# EAGLE design knife (EAGLE 7.2.0)
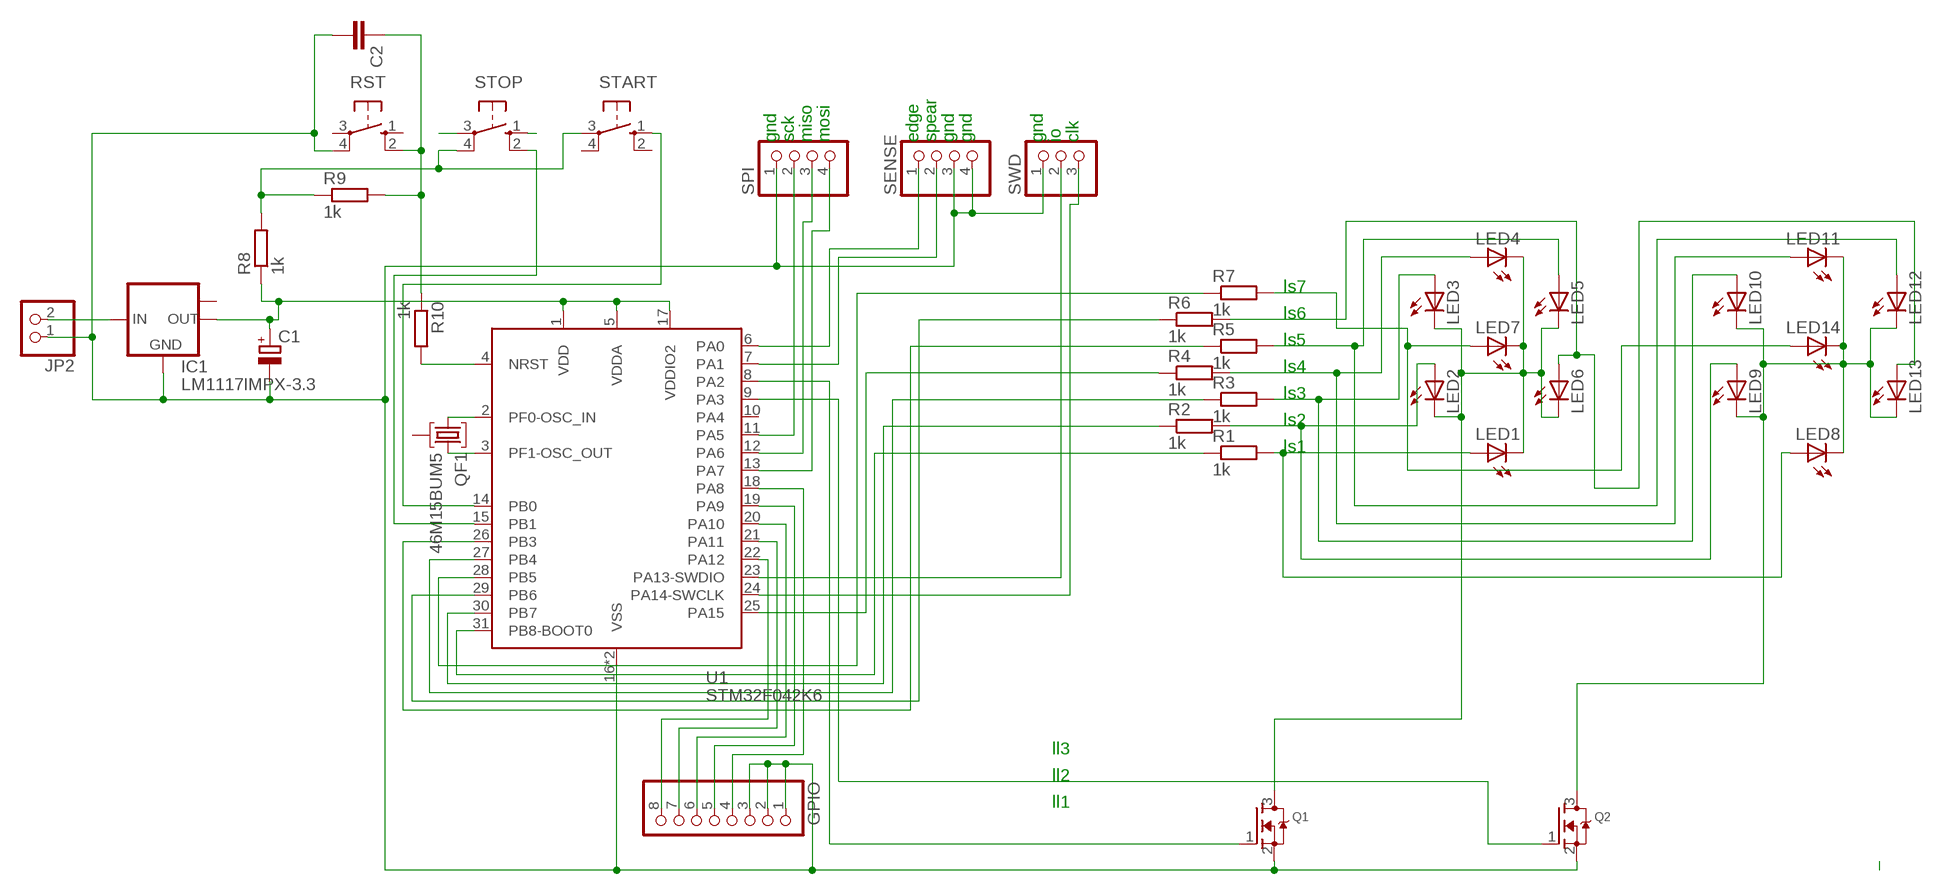
[diagram p0: schematic, sheet 1]

## Parts
C1  CPOL-EUSMCD  [SMC_D]
C2  C-EUC1206  [C1206]
GPIO  PINHD-1X8  [1X08]
IC1  LM1117IMPX-3.3  [SOT223]
JP2  PINHD-1X2  [1X02]
LED1  LEDSQR2X5  [LED2X5]
LED2  LEDSQR2X5  [LED2X5]
LED3  LEDSQR2X5  [LED2X5]
LED4  LEDSQR2X5  [LED2X5]
LED5  LEDSQR2X5  [LED2X5]
LED6  LEDSQR2X5  [LED2X5]
LED7  LEDSQR2X5  [LED2X5]
LED8  LEDSQR2X5  [LED2X5]
LED9  LEDSQR2X5  [LED2X5]
LED10  LEDSQR2X5  [LED2X5]
LED11  LEDSQR2X5  [LED2X5]
LED12  LEDSQR2X5  [LED2X5]
LED13  LEDSQR2X5  [LED2X5]
LED14  LEDSQR2X5  [LED2X5]
Q1  MOSFET-NREFLOW  [SOT23]
Q2  MOSFET-NREFLOW  [SOT23]
QF1  46M15BUM5  [UM5]
R1  1k  R-EU_R0805  [R0805]
R2  1k  R-EU_R0805  [R0805]
R3  1k  R-EU_R0805  [R0805]
R4  1k  R-EU_R0805  [R0805]
R5  1k  R-EU_R0805  [R0805]
R6  1k  R-EU_R0805  [R0805]
R7  1k  R-EU_R0805  [R0805]
R8  1k  R-EU_R1206  [R1206]
R9  1k  R-EU_R1206  [R1206]
R10  1k  R-EU_R1206  [R1206]
RST  10-XX  [B3F-10XX]
SENSE  PINHD-1X4  [1X04]
SPI  PINHD-1X4  [1X04]
START  10-XX  [B3F-10XX]
STOP  10-XX  [B3F-10XX]
SWD  PINHD-1X3  [1X03]
U1  STM32F042K6  [QFP32-7X7]

## Nets
N$1: LED1.K(C) LED2.K(C) LED3.K(C) LED4.K(C) LED5.K(C) LED6.K(C) LED7.K(C) Q1.3(D)
N$4: LED1.A LED8.A R1.2
N$5: LED2.A LED9.A R2.2
N$6: LED3.A LED10.A R3.2
N$7: R7.1 U1.28(PB5)
N$8: R6.1 U1.29(PB6)
N$9: LED4.A LED11.A R4.2
N$10: LED5.A LED12.A R5.2
N$11: R5.1 U1.26(PB3)
N$12: R4.1 U1.25(PA15)
N$13: LED6.A LED13.A R6.2
N$14: LED7.A LED14.A R7.2
N$15: R3.1 U1.27(PB4)
N$16: R2.1 U1.30(PB7)
N$18: LED8.K(C) LED9.K(C) LED10.K(C) LED11.K(C) LED12.K(C) LED13.K(C) LED14.K(C) Q2.3(D)
N$19: R1.1 U1.31(PB8-BOOT0)
N$22: Q2.1(G) U1.9(PA3)
N$23: Q1.1(G) U1.8(PA2)
N$24: C1.- C2.2 GPIO.1 GPIO.2 GPIO.3 IC1.1(GND) JP2.1 Q1.2(S) Q2.2(S) RST.4(P1) SENSE.3 SENSE.4 SPI.1 SWD.1 U1.16(VSS) U1.32(VSS)
N$25: SPI.2 U1.11(PA5)
N$26: SPI.3 U1.12(PA6)
N$27: SPI.4 U1.13(PA7)
N$28: C1.+ IC1.2(OUT) R8.1 U1.1(VDD) U1.5(VDDA) U1.17(VDDIO2)
N$29: QF1.1 U1.2(PF0-OSC_IN)
N$30: QF1.3 U1.3(PF1-OSC_OUT)
N$31: IC1.3(IN) JP2.2
N$32: R8.2 R9.1 START.3(P) STOP.4(P1)
N$33: START.1(S) U1.14(PB0)
N$34: STOP.2(S1) U1.15(PB1)
N$35: C2.1 R9.2 R10.1 RST.2(S1)
N$36: SENSE.1 U1.6(PA0)
N$37: SENSE.2 U1.7(PA1)
N$38: SWD.2 U1.23(PA13-SWDIO)
N$39: SWD.3 U1.24(PA14-SWCLK)
N$40: R10.2 U1.4(NRST)
N$41: GPIO.8 U1.22(PA12)
N$42: GPIO.7 U1.21(PA11)
N$43: GPIO.6 U1.20(PA10)
N$44: GPIO.5 U1.19(PA9)
N$45: GPIO.4 U1.18(PA8)
N$46: STOP.3(P)
N$47: STOP.1(S)
Unconnected: IC1.TAB(OUT1) QF1.2 RST.1(S) RST.3(P) START.2(S1) START.4(P1) U1.10(PA4)

## Notes on the sheet
- gnd | sck | miso | mosi | edge | spear | gnd | gnd | gnd | io | clk
- ls7
- ls6
- ls5
- ls4
- ls3
- ls2
- ls1
- ll3
- ll2
- ll1

## Library data of the parts
C1 = resistor:CPOL-EU: POLARIZED CAPACITOR, European symbol
C2 = resistor:C-EU: CAPACITOR, European symbol
GPIO = pinhead:PINHD-1X8: PIN HEADER
IC1 = lm1117:LM1117IMPX-*
JP2 = pinhead:PINHD-1X2: PIN HEADER
LED1-LED14 = led:LED: LED OSRAM: - CHIPLED LG R971, LG N971, LY N971, LG Q971, LY Q971, LO R971, LY R971 LH N974, LH R974 LS Q976, LO Q976, LY Q976 LO Q996 - Hyper CHIPLED LW Q18S LB Q993, LB Q99A, LB R99A - SideLED LS A670, LO A670, LY A670, LG A670, LP A670 LB A673, LV A673, LT A673, LW A673 LH A674 LY A675 LS A676, LA A676, LO A676, LY A676, LW A676 LS A679, LY A679, LG A679 - Hyper Micro SIDELED® LS Y876, LA Y876, LO Y876, LY Y876 LT Y87S - SmartLED LW L88C, LW L88S LB L89C, LB L89S, LG L890 LS L89K, LO L89K, LY L89K LS L896, LA L896, LO L896, LY L896 - TOPLED LS T670, LO T670, LY T670, LG T670, LP T670 LSG T670, LSP T670, LSY T670, LOP T670, LYG T670 LG T671, LOG T671, LSG T671 LB T673, LV T673, LT T673, LW T673 LH T674 LS T676, LA T676, LO T676, LY T676, LB T676, LH T676, LSB T676, LW T676 LB T67C, LV T67C, LT T67C, LS T67K, LO T67K, LY T67K, LW E67C LS E67B, LA E67B, LO E67B, LY E67B, LB E67C, LV E67C, LT E67C LW T67C LS T679, LY T679, LG T679 LS T770, LO T770, LY T770, LG T770, LP T770 LB T773, LV T773, LT T773, LW T773 LH T774 LS E675, LA E675, LY E675, LS T675 LS T776, LA T776, LO T776, LY T776, LB T776 LHGB T686 LT T68C, LB T68C - Hyper Mini TOPLED® LB M676 - Mini TOPLED Santana® LG M470 LS M47K, LO M47K, LY M47K Source: http://www.osram.convergy.de LUXEON: - LUMILED® LXK2-PW12-R00, LXK2-PW12-S00, LXK2-PW14-U00, LXK2-PW14-V00 LXK2-PM12-R00, LXK2-PM12-S00, LXK2-PM14-U00 LXK2-PE12-Q00, LXK2-PE12-R00, LXK2-PE12-S00, LXK2-PE14-T00, LXK2-PE14-U00 LXK2-PB12-K00, LXK2-PB12-L00, LXK2-PB12-M00, LXK2-PB14-N00, LXK2-PB14-P00, LXK2-PB14-Q00 LXK2-PR12-L00, LXK2-PR12-M00, LXK2-PR14-Q00, LXK2-PR14-R00 LXK2-PD12-Q00, LXK2-PD12-R00, LXK2-PD12-S00 LXK2-PH12-R00, LXK2-PH12-S00 LXK2-PL12-P00, LXK2-PL12-Q00, LXK2-PL12-R00 Source: www.luxeon.com KINGBRIGHT: KA-3528ASYC Source: www.kingbright.com
Q1 Q2 = adafruit:MOSFET-N: N-Channel Mosfet 2N7002E - 60V 260mA SOT23 [Digikey: 2N7002ET1GOSTR-ND] - REEL BSH103 - 30V 850mA SOT23 [Digikey: 568-5013-1-ND]
QF1 = crystal:46M15BUM5: Monolithic Crystal Filters Source: www.vanlong.com; OC_FARNELL: unknown; OC_NEWARK: unknown
R1-R7 = resistor:R-EU_: RESISTOR, European symbol
R8-R10 = rcl:R-EU_: RESISTOR, European symbol
RST START STOP = switch-omron:10-XX: OMRON SWITCH; MPN: B3F-1000; OC_FARNELL: 176432; OC_NEWARK: 36M3542
SENSE SPI = pinhead:PINHD-1X4: PIN HEADER
SWD = pinhead:PINHD-1X3: PIN HEADER
U1 = STM32F042K:STM32F042K6

## Board
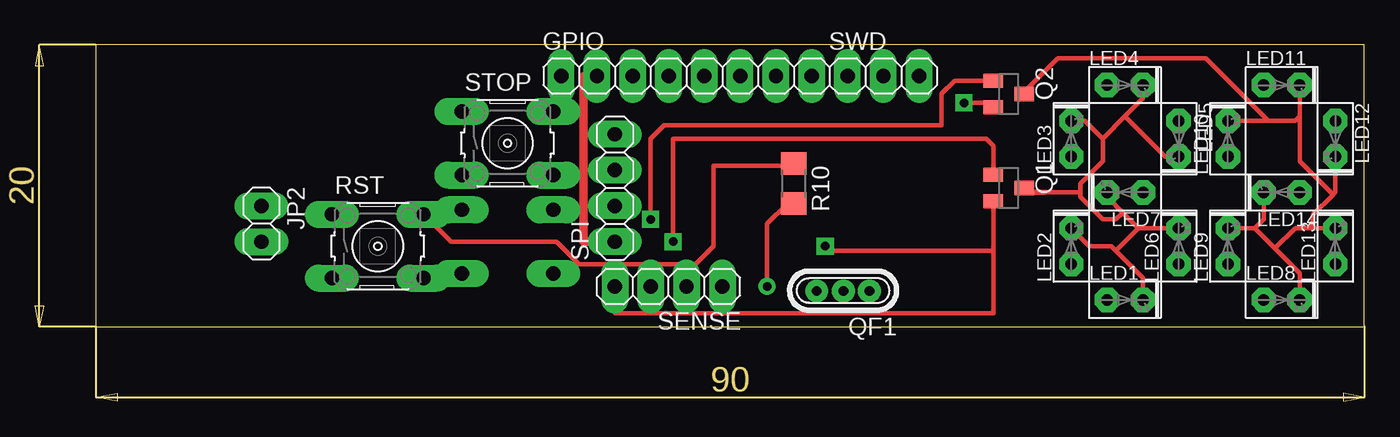
[diagram p1: board, top side]
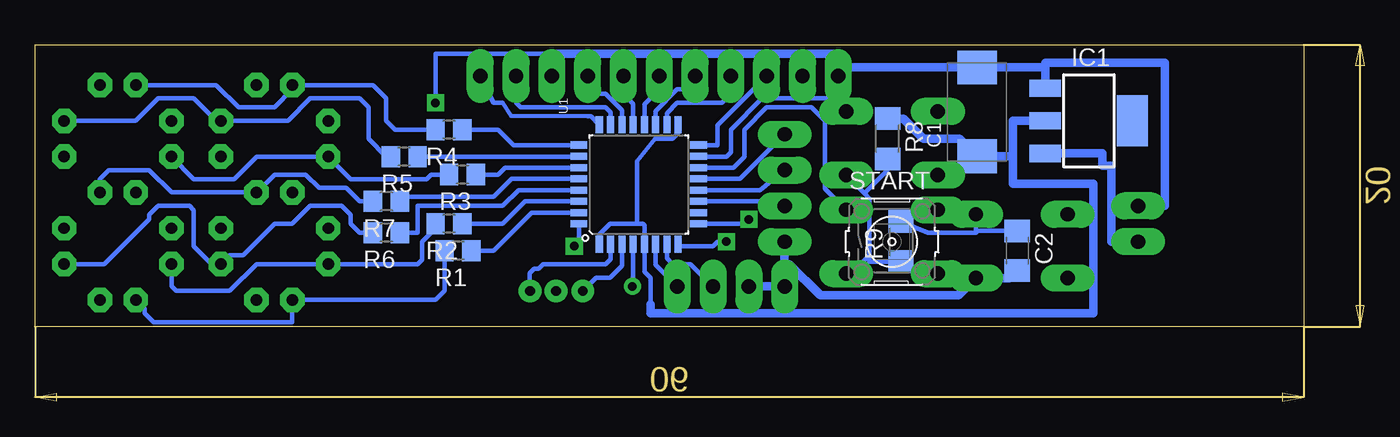
[diagram p2: board, bottom side, seen from below]

Size 90 x 20 mm. Coordinates in mm from the lower left corner, seen from the top.
Outline: 0,0 90,0 90,20 0,20 0,0
Copper layers (1*16): Top 0.035mm / dielectric 1.5mm / Bottom 0.035mm
Design rules "default *": minimum track width 10mil, minimum drill 24mil, track to track 8mil, track to pad 8mil, pad to pad 8mil, via to via 8mil, smd to smd 8mil, copper to edge 40mil, drill to drill 8mil, minimum pad ring 18mil, minimum via ring 12mil, stop-mask expansion 4mil, vias tented up to drill 0mil, thermal gap 10mil

### Footprints (pad centres in the part's own frame; a part is rotated, then mirrored left to right if it is on the bottom)
SMC_D = smd 2.4 x 2.8: + -3.15,0; - 3.15,0
C1206 = smd 1.6 x 1.8: 1 -1.4,0; 2 1.4,0
1X08 = drill 1.016 long: 1 -8.89,0; 2 -6.35,0; 3 -3.81,0; 4 -1.27,0; 5 1.27,0; 6 3.81,0; 7 6.35,0; 8 8.89,0
SOT223 = smd 1.219 x 2.235: 1 -2.311,-3.099; 2 0,-3.099; 3 2.311,-3.099 | smd 3.6 x 2.2: TAB 0,3.099
1X02 = drill 1.016 long: 1 -1.27,0; 2 1.27,0
LED2X5 = drill 0.813 octagon: A -1.27,0; K 1.27,0
SOT23 = smd 1 x 1.4: 1 -0.95,-1.1; 2 0.95,-1.1; 3 0,1.1
UM5 = drill 0.7 pad 1.2: 1 -1.875,0; 2 -0.027,0; 3 1.875,0
R0805 = smd 1.3 x 1.5: 1 -0.95,0; 2 0.95,0
R1206 = smd 1.6 x 1.803: 1 -1.422,0; 2 1.422,0
B3F-10XX = drill 1.016 long: 1 -3.251,2.261; 2 3.251,2.261; 3 -3.251,-2.261; 4 3.251,-2.261
1X04 = drill 1.016 long: 1 -3.81,0; 2 -1.27,0; 3 1.27,0; 4 3.81,0
1X03 = drill 1.016 long: 1 -2.54,0; 2 0,0; 3 2.54,0
QFP32-7X7 = smd 1.2 x 0.5: 1 -4.25,2.8; 2 -4.25,2; 3 -4.25,1.2; 4 -4.25,0.4; 5 -4.25,-0.4; 6 -4.25,-1.2; 7 -4.25,-2; 8 -4.25,-2.8; 17 4.25,-2.8; 18 4.25,-2; 19 4.25,-1.2; 20 4.25,-0.4; 21 4.25,0.4; 22 4.25,1.2; 23 4.25,2; 24 4.25,2.8 | smd 0.5 x 1.2: 9 -2.8,-4.25; 10 -2,-4.25; 11 -1.2,-4.25; 12 -0.4,-4.25; 13 0.4,-4.25; 14 1.2,-4.25; 15 2,-4.25; 16 2.8,-4.25; 25 2.8,4.25; 26 2,4.25; 27 1.2,4.25; 28 0.4,4.25; 29 -0.4,4.25; 30 -1.2,4.25; 31 -2,4.25; 32 -2.8,4.25

### Placement (x,y rotation side)
C1  23.18,15.24 90 bottom
C2  20.32,5.4 270 bottom
GPIO  41.91,17.78 0 top
IC1  15.24,14.61 270 bottom
JP2  11.75,7.3 270 top
LED1  73.03,1.91 0 top
LED2  69.22,5.71 90 top
LED3  69.22,13.34 90 top
LED4  73.03,17.14 0 top
LED5  76.83,13.34 270 top
LED6  76.83,5.71 90 top
LED7  73.03,9.53 180 top
LED8  84.14,1.91 0 top
LED9  80.33,5.71 90 top
LED10  80.33,13.34 90 top
LED11  84.14,17.14 0 top
LED12  87.95,13.34 270 top
LED13  87.95,5.71 90 top
LED14  84.14,9.53 180 top
Q1  64.77,9.84 270 top
Q2  64.77,16.51 270 top
QF1  53.02,2.54 180 top
R1  60.01,5.4 180 bottom
R2  60.64,7.3 180 bottom
R3  59.69,10.79 180 bottom
R4  60.64,13.97 180 bottom
R5  63.82,12.06 180 bottom
R6  65.09,6.67 180 bottom
R7  65.09,8.89 180 bottom
R8  29.53,13.34 270 bottom
R9  28.57,6.03 90 bottom
R10  49.53,10.16 270 top
RST  20,5.71 0 top
SENSE  40.64,2.86 180 top
SPI  36.83,9.84 90 top
START  29.21,6.03 0 bottom
STOP  29.21,13.02 0 top
SWD  55.88,17.78 0 top
U1  47.18,10.09 90 bottom

### Tracks (layer width: path | path; a pad name or v marks a point on that pad's centre or on a via)
N$1
  Top 0.305: LED1.K 74.3,3.49 72.39,5.4 | 72.39,5.4 72.07,5.71 70.48,5.71 LED2.K | LED6.K 73.98,6.99 | 73.98,6.99 72.39,5.4 | LED7.K 71.75,9.21 72.87,8.1 | 72.87,8.1 73.98,6.99 | LED3.K 70.17,14.61 71.44,13.34 | 71.44,13.34 71.44,11.75 69.85,10.16 69.85,9.53 | 69.85,9.53 69.85,9.21 71.44,7.62 72.39,7.62 72.87,8.1 | LED4.K 74.3,16.19 73.03,14.92 | 73.03,14.92 71.44,13.34 | LED5.K 75.88,12.06 73.03,14.92 | 67.31,9.53 69.85,9.53
  Top 0.406: 67.31,9.53 66.19,9.53 Q1.3
N$4
  Bottom 0.305: R1.2 60.96,2.54 61.59,1.91 LED1.A 71.75,0.32 81.6,0.32 82.23,0.95 82.23,1.27 LED8.A
N$5
  Bottom 0.305: R2.2 61.59,6.99 62.55,6.03 62.55,4.76 62.87,4.45 LED2.A 74.3,4.45 76.2,2.54 80.01,2.54 80.33,2.86 LED9.A
N$6
  Bottom 0.305: R3.2 61.91,10.79 62.23,10.48 67.63,10.48 LED3.A 74.3,12.06 75.88,10.48 78.74,10.48 LED10.A
N$7
  Bottom 0.305: R7.1 64.14,9.21 57.47,9.21 56.19,10.49 U1.28
N$8
  Bottom 0.305: R6.1 62.87,6.67 62.87,8.57 56.83,8.57 55.72,9.69 U1.29
N$9
  Bottom 0.305: R4.2 64.45,13.97 65.09,14.61 65.09,16.19 66.04,17.14 LED4.A 71.75,16.83 73.03,15.56 75.56,15.56 77.15,17.14 LED11.A
N$10
  Bottom 0.305: R5.2 65.09,12.06 66.36,13.34 66.36,15.56 66.99,16.19 70.48,16.19 72.07,14.61 LED5.A 77.15,14.61 78.74,16.19 81.28,16.19 82.87,14.61 LED12.A
N$11
  Bottom 0.305: R5.1 51.45,12.06 U1.26
N$12
  Bottom 0.305: R4.1 57.15,13.97 56.07,12.89 U1.25
N$13
  Bottom 0.305: R6.2 66.99,6.67 67.63,7.3 67.63,7.94 68.26,8.57 70.48,8.57 71.75,7.3 73.03,7.3 75.25,5.08 76.2,5.08 LED6.A 77.47,4.45 78.74,5.71 78.74,8.26 79.06,8.57 81.28,8.57 81.92,7.94 81.92,7.62 85.09,4.45 LED13.A
N$14
  Bottom 0.305: R7.2 66.99,8.89 67.94,9.84 69.85,9.84 70.8,10.79 73.03,10.79 LED7.A 80.33,9.53 81.92,11.11 84.77,11.11 85.41,10.48 LED14.A
N$15
  Bottom 0.305: R3.1 57.15,10.79 56.66,11.29 U1.27
N$16
  Bottom 0.305: R2.1 56.83,7.3 55.24,8.89 U1.30
N$18
  Top 0.305: LED8.K 85.41,3.81 83.66,5.56 | 83.66,5.56 82.23,6.99 | 82.23,6.99 LED9.K | LED13.K 86.04,6.99 | 86.04,6.99 85.09,6.99 83.66,5.56 | LED14.K 82.87,7.62 82.23,6.99 | LED12.K 87.95,9.53 87.79,9.37 | 87.79,9.37 86.36,7.94 86.36,7.3 86.04,6.99 | LED11.K 85.41,14.92 | 85.41,14.92 85.41,11.75 87.79,9.37 | LED10.K 83.19,14.61 | 83.19,14.61 85.09,14.61 85.41,14.92 | Q2.3 65.87,16.66 68.26,19.05 78.74,19.05 83.19,14.61
N$19
  Bottom 0.305: R1.1 57.47,5.4 54.77,8.09 U1.31
N$22  (via drill 0.6)
  Top 0.305: Q2.1 60.96,17.46 60.01,16.51 60.01,14.29 40.32,14.29 39.37,13.34 v39.37,7.62
  Bottom 0.305: v39.37,7.62 39.7,7.29 U1.9
N$23  (via drill 0.6)
  Top 0.305: Q1.1 63.67,12.85 63.18,13.34 40.96,13.34 v40.96,6.03
  Bottom 0.305: v40.96,6.03 41.59,6.03 41.91,5.71 44.26,5.71 U1.8
N$24  (via drill 0.6)
  Top 0.305: Q1.2 63.67,5.4 | 63.67,5.4 63.67,0.95 36.83,0.95 SENSE.4 | v51.75,5.71 51.75,5.4 63.67,5.4 | Q2.2 63.67,15.88 v61.59,15.88
  Top 0.61: SPI.1 34.61,6.03 34.61,17.78 GPIO.2
  Bottom 0.305: GPIO.3 41.59,14.29 41.59,12.89 U1.16 | U1.32 51.43,5.71 v51.75,5.71 | v61.59,15.88 61.59,19.37 53.34,19.37
  Bottom 0.61: SWD.1 53.34,19.37 38.1,19.37 | 38.1,19.37 35.56,19.37 | 35.56,19.37 33.02,19.37 33.02,18.39 | 33.02,18.39 GPIO.1 | GPIO.2 35.56,19.37 | GPIO.3 38.1,19.37 | SENSE.3 SENSE.4 36.83,4.45 | 36.83,4.45 SPI.1 | 33.02,18.39 C1.- 18.34,18.39 | IC1.1 18.34,18.39 | JP2.1 9.84,8.57 9.84,18.73 18.34,18.73 18.34,18.39 | 36.83,4.45 36.51,4.45 34.29,2.22 24.49,2.22 RST.4 20.86,3.45 C2.2
N$25
  Bottom 0.305: SPI.2 37.78,8.89 U1.11
N$26
  Bottom 0.305: SPI.3 38.57,9.69 U1.12
N$27
  Bottom 0.305: SPI.4 39.99,10.49 U1.13
N$28
  Bottom 0.305: U1.1 49.98,6.54 49.21,7.3 47.31,7.3 | 47.31,7.3 46.89,7.3 46.78,7.2 U1.5 46.78,3.92 46.35,3.49 46.35,1.59 | U1.17 44.38,13.72 44.77,13.34 46.04,13.34 47.31,11.75 47.31,7.3
  Bottom 0.61: R8.1 28.41,14.76 26.99,13.34 24.42,13.34 C1.+ 20.64,12.09 | IC1.2 20.64,14.61 20.64,12.09 | 20.64,12.09 20.64,10.16 14.92,10.16 14.92,0.95 46.35,0.95 46.35,1.59
N$29
  Bottom 0.305: U1.2 49.18,4.79 49.53,4.45 53.98,4.45 54.29,4.13 54.61,4.13 54.93,3.81 54.93,2.57 QF1.1
N$30
  Bottom 0.305: U1.3 48.38,4.33 49.21,3.49 50.2,3.49 QF1.3
N$31
  Bottom 0.61: IC1.3 14.29,12.29 14.29,11.43 13.65,11.43 13.65,6.03 JP2.2
N$32
  Bottom 0.305: STOP.4 31.17,9.47 | 31.17,9.47 30.8,9.09 30.8,5.08 | 30.8,5.08 32.11,3.77 START.3 | R9.1 30.8,4.61 30.8,5.08 | R8.2 29.53,11.11 31.17,9.47
N$33
  Bottom 0.305: START.1 33.97,9.8 33.97,14.61 34.92,15.56 38.1,15.56 39.69,13.97 39.69,12.06 40.46,11.29 U1.14
N$34
  Bottom 0.305: STOP.2 32.46,16.19 38.42,16.19 40.64,13.97 40.64,12.38 40.96,12.06 42.91,12.06 U1.15
N$35
  Top 0.305: R10.1 49.38,11.43 43.81,11.43 43.81,5.71 42.55,4.45 34.29,4.45 32.7,6.03 25.2,6.03 RST.2
  Bottom 0.305: RST.2 23.25,6.67 | 23.25,6.67 26.67,6.67 R9.2 | C2.1 23.12,6.8 23.25,6.67
N$36
  Bottom 0.305: SENSE.1 45.98,4.39 U1.6
N$37
  Bottom 0.305: SENSE.2 43.5,4.45 44.77,4.45 45.18,4.86 U1.7
N$38
  Bottom 0.305: U1.23 49.18,15.21 49.53,15.56 55.56,15.56 55.88,15.88 SWD.2
N$39
  Bottom 0.305: U1.24 50.56,14.92 50.8,14.92 56.25,14.97 56.83,15.88 57.47,15.88 SWD.3
N$40  (via drill 0.6)
  Top 0.305: R10.2 49.06,8.74 47.62,7.3 v47.62,2.86
  Bottom 0.305: v47.62,2.86 47.58,3.77 U1.4
N$41
  Bottom 0.305: U1.22 48.38,15.36 49.53,16.51 50.48,16.51 50.8,16.83 GPIO.8
N$42
  Bottom 0.305: U1.21 47.58,15.83 48.26,16.51 GPIO.7
N$43
  Bottom 0.305: U1.20 46.78,15.77 45.72,16.83 GPIO.6
N$44
  Bottom 0.305: U1.19 45.98,15.3 44.45,16.83 43.5,16.83 43.18,17.14 GPIO.5
N$45
  Bottom 0.305: U1.18 45.18,15.14 44.45,15.88 41.27,15.88 40.64,16.51 GPIO.4